# Altium project LVTN.PrjPcb
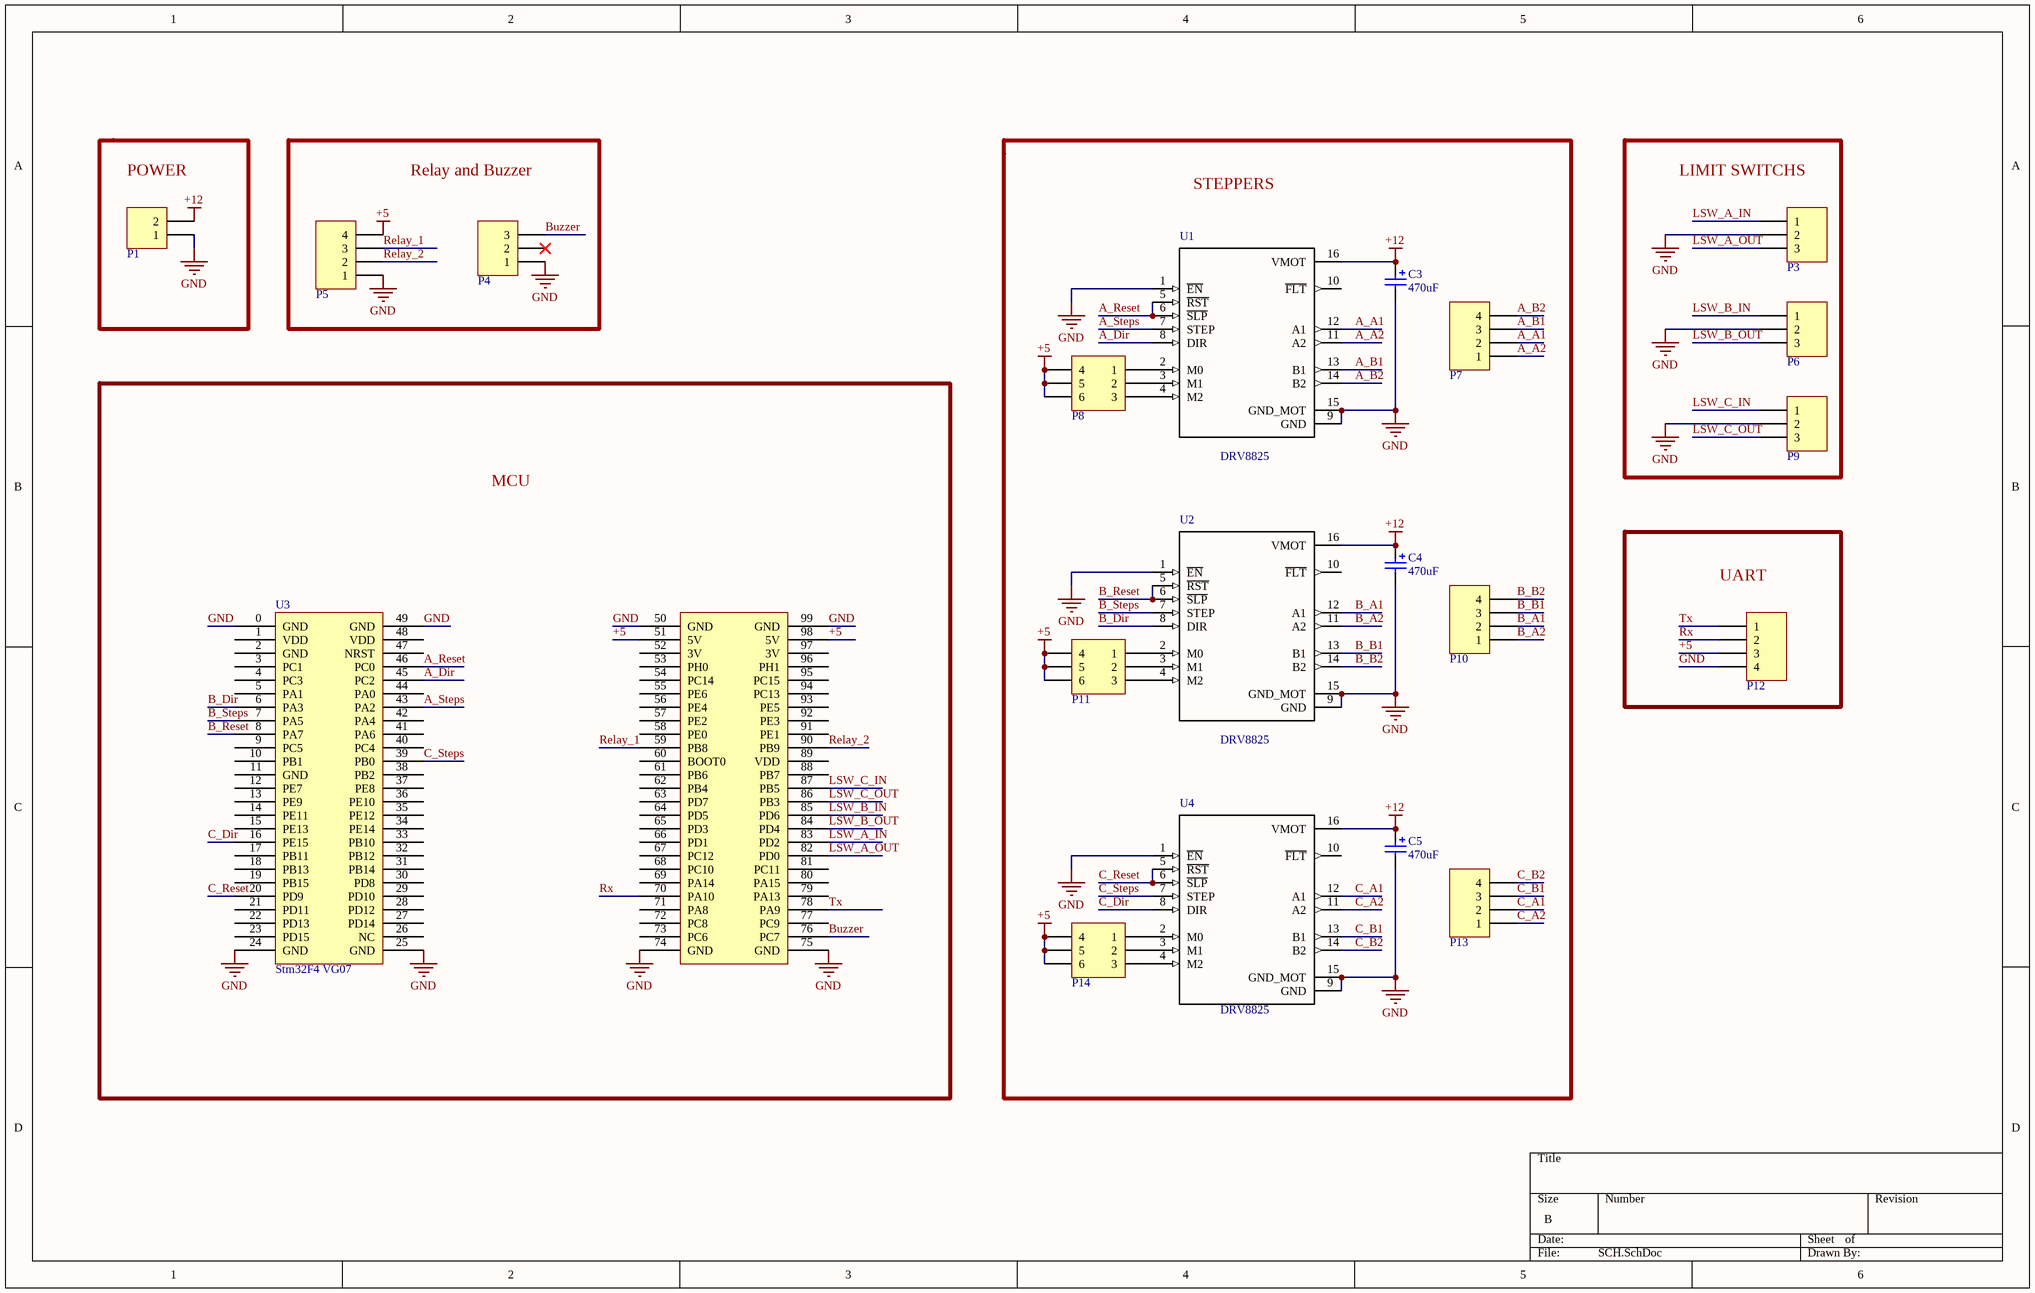
[diagram p0: SCH.SchDoc]
1 sheet, 20 parts. Net scope: global (net labels, ports and power ports of the same name join across sheets).
Board file: PCB.PcbDoc

## Sheet SCH.SchDoc
size B

### Parts
C3  value 470uF  [CP1.5/3.4]  (hidden comment: Cap Pol)
C4  value 470uF  [CP1.5/3.4]  (hidden comment: Cap Pol)
C5  value 470uF  [CP1.5/3.4]  (hidden comment: Cap Pol)
P1  Domino 2  [DOMINO 2- 5mm]  (value not drawn)
P3  Header 3  [JP3]  (value not drawn)
P4  Header 3  [JP3]  (value not drawn)
P5  Domino 4  [DOMINO 4 -5mm]  (value not drawn)
P6  Header 3  [JP3]  (value not drawn)
P7  Header 4  [JP4]  (value not drawn)
P8  Header 3X2  [JP3x2]  (value not drawn)
P9  Header 3  [JP3]  (value not drawn)
P10  Header 4  [JP4]  (value not drawn)
P11  Header 3X2  [JP3x2]  (value not drawn)
P12  Header 4  [JP4]  (value not drawn)
P13  Header 4  [JP4]  (value not drawn)
P14  Header 3X2  [JP3x2]  (value not drawn)
U1  DRV8825  [*IC_DRV8825_STEPPER_MOTOR_DRIVER_CARRIER]
U2  DRV8825  [*IC_DRV8825_STEPPER_MOTOR_DRIVER_CARRIER]
U3  Stm32F4 VG07  [stm32f4 hoan chinh]
U4  DRV8825  [*IC_DRV8825_STEPPER_MOTOR_DRIVER_CARRIER]

### Blocks framed on the sheet
POWER: P1
Relay and Buzzer: P4 P5
LIMIT SWITCHS: P3 P6 P9
MCU: U3
UART: P12

### Nets
+5: P5.4 P8.4 P8.5 P8.6 P11.4 P11.5 P11.6 P12.3 P14.4 P14.5 P14.6 U3.51(5V) U3.98(5V)
+12: C3.1 C4.1 C5.1 P1.2 U1.16(VMOT) U2.16(VMOT) U4.16(VMOT)
GND: C3.2 C4.2 C5.2 P1.1 P3.2 P4.1 P5.1 P6.2 P9.2 P12.4 U1.1(~{EN}) U1.9(GND) U1.15(GND_MOT) U2.1(~{EN}) U2.9(GND) U2.15(GND_MOT) U3.0(GND) U3.24(GND) U3.25(GND) U3.49(GND) U3.50(GND) U3.74(GND) U3.75(GND) U3.99(GND) U4.1(~{EN}) U4.9(GND) U4.15(GND_MOT)
A_A1: P7.2 U1.12(A1)
A_A2: P7.1 U1.11(A2)
A_B1: P7.3 U1.13(B1)
A_B2: P7.4 U1.14(B2)
A_Dir: U1.8(DIR) U3.45(PC2)
A_Reset: U1.5(~{RST}) U1.6(~{SLP}) U3.46(PC0)
A_Steps: U1.7(STEP) U3.43(PA2)
B_A1: P10.2 U2.12(A1)
B_A2: P10.1 U2.11(A2)
B_B1: P10.3 U2.13(B1)
B_B2: P10.4 U2.14(B2)
B_Dir: U2.8(DIR) U3.6(PA3)
B_Reset: U2.5(~{RST}) U2.6(~{SLP}) U3.8(PA7)
B_Steps: U2.7(STEP) U3.7(PA5)
Buzzer: P4.3 U3.76(PC7)
C_A1: P13.2 U4.12(A1)
C_A2: P13.1 U4.11(A2)
C_B1: P13.3 U4.13(B1)
C_B2: P13.4 U4.14(B2)
C_Dir: U3.16(PE15) U4.8(DIR)
C_Reset: U3.20(PD9) U4.5(~{RST}) U4.6(~{SLP})
C_Steps: U3.39(PB0) U4.7(STEP)
LSW_A_IN: P3.1 U3.83(PD2)
LSW_A_OUT: P3.3 U3.82(PD0)
LSW_B_IN: P6.1 U3.85(PD6)
LSW_B_OUT: P6.3 U3.84(PD4)
LSW_C_IN: P9.1 U3.87(PB5)
LSW_C_OUT: P9.3 U3.86(PB3)
Relay_1: P5.3 U3.59(PB8)
Relay_2: P5.2 U3.90(PB9)
Rx: P12.2 U3.70(PA10)
Tx: P12.1 U3.78(PA9)
NetP8_1: P8.1 U1.2(M0)
NetP8_2: P8.2 U1.3(M1)
NetP8_3: P8.3 U1.4(M2)
NetP11_1: P11.1 U2.2(M0)
NetP11_2: P11.2 U2.3(M1)
NetP11_3: P11.3 U2.4(M2)
NetP14_1: P14.1 U4.2(M0)
NetP14_2: P14.2 U4.3(M1)
NetP14_3: P14.3 U4.4(M2)

Not connected (* = marked no-connect by the designer): P4 2*; U1 10(~{FLT}); U2 10(~{FLT}); U3 1(VDD) 2(GND) 3(PC1) 4(PC3) 5(PA1) 9(PC5) 10(PB1) 11(GND) 12(PE7) 13(PE9) 14(PE11) 15(PE13) 17(PB11) 18(PB13) 19(PB15) 21(PD11) 22(PD13) 23(PD15) 26(NC) 27(PD14) 28(PD12) 29(PD10) 30(PD8) 31(PB14) 32(PB12) 33(PB10) 34(PE14) 35(PE12) 36(PE10) 37(PE8) 38(PB2) 40(PC4) 41(PA6) 42(PA4) 44(PA0) 47(NRST) 48(VDD) 52(3V) 53(PH0) 54(PC14) 55(PE6) 56(PE4) 57(PE2) 58(PE0) 60(BOOT0) 61(PB6) 62(PB4) 63(PD7) 64(PD5) 65(PD3) 66(PD1) 67(PC12) 68(PC10) 69(PA14) 71(PA8) 72(PC8) 73(PC6) 77(PC9) 79(PA13) 80(PA15) 81(PC11) 88(PB7) 89(VDD) 91(PE1) 92(PE3) 93(PE5) 94(PC13) 95(PC15) 96(PH1) 97(3V); U4 10(~{FLT})

### Notes on the sheet
- STEPPERS

### Library data of the parts
C3-C5 = Cap Pol: Polarized Capacitor (Radial)
P1 = Domino 2: Domino, 2-Pin; LatestRevisionDate: 17-Jul-2002; LatestRevisionNote: Re-released for DXP Platform.; Publisher: Altium Limited
P3 P4 P6 P9 = Header 3: Header, 3-Pin; LatestRevisionDate: 17-Jul-2002; LatestRevisionNote: Re-released for DXP Platform.; Publisher: Altium Limited
P5 = Domino 4: Domino 4-Pin; LatestRevisionDate: 17-Jul-2002; LatestRevisionNote: Re-released for DXP Platform.; Publisher: Altium Limited
P7 P10 P12 P13 = Header 4: Header, 4-Pin; LatestRevisionDate: 17-Jul-2002; LatestRevisionNote: Re-released for DXP Platform.; Publisher: Altium Limited
P8 P11 P14 = Header 3X2: Header, 3-Pin, Dual row; LatestRevisionDate: 17-Jul-2002; LatestRevisionNote: Re-released for DXP Platform.; Publisher: Altium Limited
U1 U2 U4 = DRV8825_STEPPER_MOTOR_DRIVER_CARRIER: DRV8825 Motor Controller/Driver Power Management Evaluation Board; MP: DRV8825 STEPPER MOTOR DRIVER CARRIER; MF: Pololu; SnapEDA_Link: https://www.snapeda.com/parts/DRV8825%20STEPPER%20MOTOR%20DRIVER%20CARRIER/Pololu/view-part/1449238/?ref=snap; Availability: Unavailable; Price: None; Package: None; Value: *
U3 = STM32F4_VG07 Hoang Loi